# EAGLE design home automation (EAGLE 9.6.2)
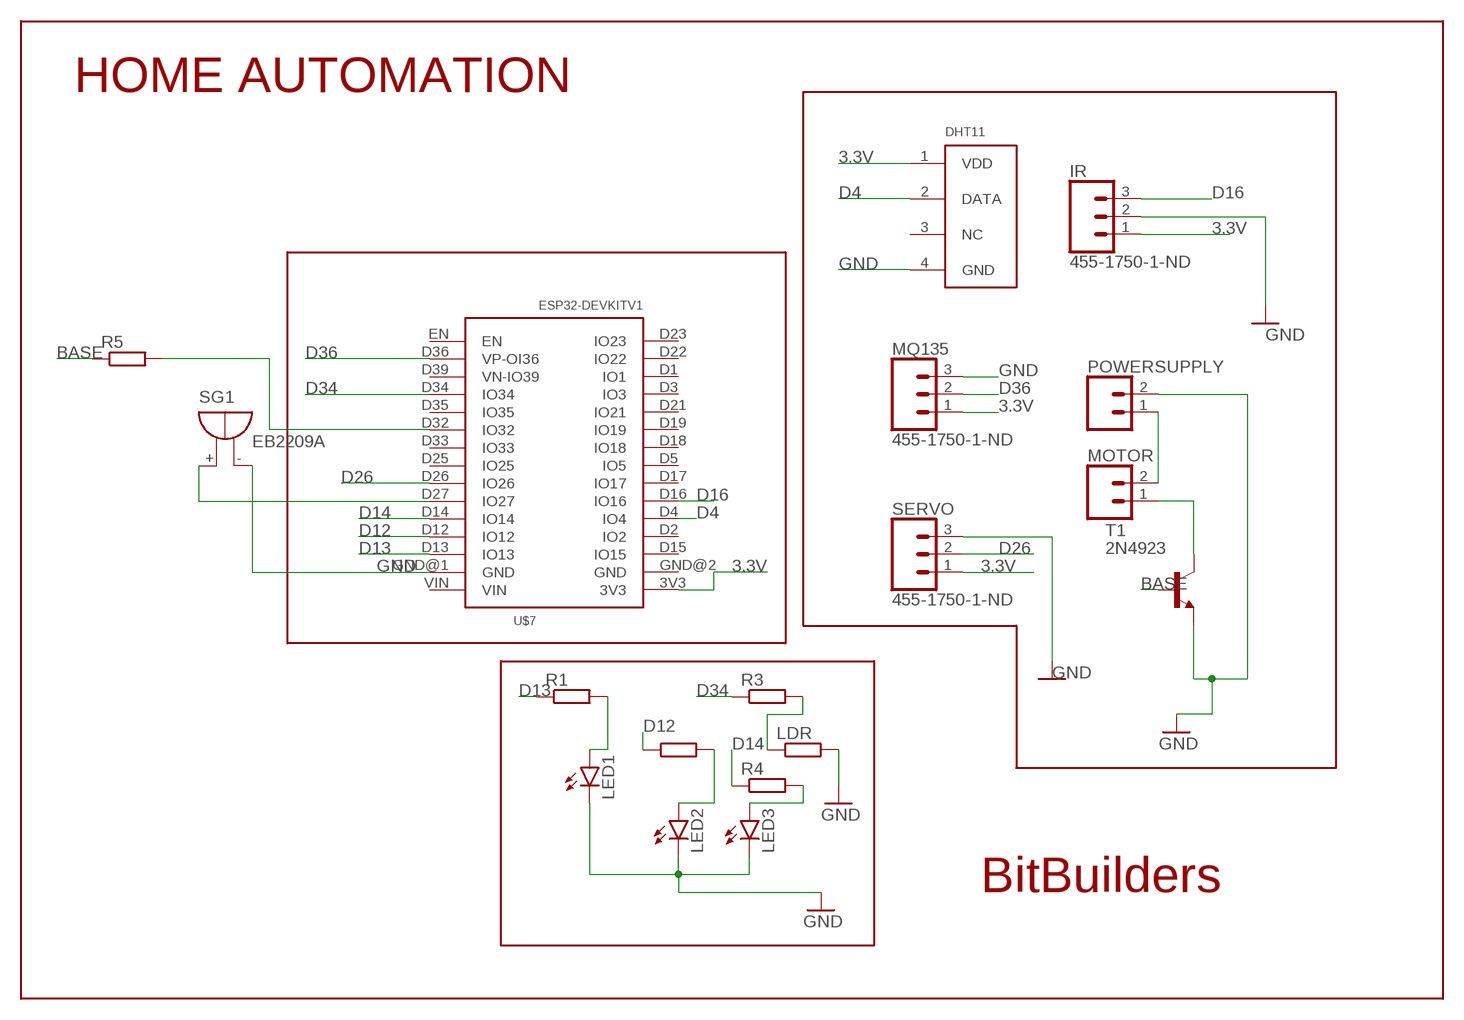
[diagram p0: schematic, sheet 1]

## Parts
DHT11  DHT11  [DHT11]
IR  455-1750-1-ND  CONN_03  [1X03]
LDR  R-EU_0204/7  [0204/7]
LED1  LED5MM  [LED5MM]
LED2  LED5MM  [LED5MM]
LED3  LED5MM  [LED5MM]
MOTOR  CONN_02  [1X02]
MQ135  455-1750-1-ND  CONN_03  [1X03]
POWERSUPPLY  CONN_02  [1X02]
R1  R-EU_0204/5  [0204/5]
R2  R-EU_0204/5  [0204/5]
R3  R-EU_0204/5  [0204/5]
R4  R-EU_0204/7  [0204/7]
R5  R-EU_0204/7  [0204/7]
SERVO  455-1750-1-ND  CONN_03  [1X03]
SG1  EB2209A  [EB2209A]
T1  2N4923  [TO126]
U$7  ESP32DEVKITV1  [ESP32-DEVKITV1]

## Nets
3.3V: DHT11.1(VDD) IR.1 MQ135.1 SERVO.1 U$7.3V3
BASE: R5.1 T1.3(B)
D4: DHT11.2(DATA) U$7.D4(IO4)
D12: R2.1 U$7.D12(IO12)
D13: R1.1 U$7.D13(IO13)
D14: R4.1 U$7.D14(IO14)
D16: IR.3 U$7.D16(IO16)
D26: SERVO.2 U$7.D26(IO26)
D34: R3.1 U$7.D34(IO34)
D36: MQ135.2 U$7.D36(VP-OI36)
GND: DHT11.4(GND) IR.2 LDR.2 LED1.K(C) LED2.K(C) LED3.K(C) MQ135.3 POWERSUPPLY.2 SERVO.3 SG1.- T1.1(E) U$7.GND@1(GND)
N$3: SG1.+ U$7.D27(IO27)
N$5: MOTOR.1 T1.2(C)
N$7: LED1.A R1.2
N$9: LED2.A R2.2
N$10: LED3.A R4.2
N$11: LDR.1 R3.2
N$16: MOTOR.2 POWERSUPPLY.1
N$17: R5.2 U$7.D32(IO32)
Unconnected: DHT11.3(NC) U$7.D1(IO1) U$7.D2(IO2) U$7.D3(IO3) U$7.D5(IO5) U$7.D15(IO15) U$7.D17(IO17) U$7.D18(IO18) U$7.D19(IO19) U$7.D21(IO21) U$7.D22(IO22) U$7.D23(IO23) U$7.D25(IO25) U$7.D33(IO33) U$7.D35(IO35) U$7.D39(VN-IO39) U$7.EN U$7.GND@2(GND) U$7.VIN

## Notes on the sheet
- HOME AUTOMATION
- BitBuilders

## Library data of the parts
DHT11 = dht:DHT11
IR MQ135 SERVO = SparkFun-Connectors:CONN_03: Multi connection point. Often used as Generic Header-pin footprint for 0.1 inch spaced/style header connections On any of the 0.1 inch spaced packages, you can populate with these: Break Away Headers - Straight <https://www.sparkfun.com/products/116> (PRT-00116) Break Away Male Headers - Right Angle <https://www.sparkfun.com/products/553> (PRT-00553) Female Headers <https://www.sparkfun.com/products/115> (PRT-00115) Break Away Headers - Machine Pin <https://www.sparkfun.com/products/117> (PRT-00117) Break Away Female Headers - Swiss Machine Pin <https://www.sparkfun.com/products/743> (PRT-00743) Stackable Header - 3 Pin (Female, 0.1") <https://www.sparkfun.com/products/13875> (PRT-13875) For SCREWTERMINALS and SPRING TERMINALS visit here: Screw Terimnals on SparkFun.com <https://www.sparkfun.com/search/results?term=Screw+Terminals> (5mm/3.5mm/2.54mm spacing) This device is also useful as a general connection point to wire up your design to another part of your project. Our various solder wires solder well into these plated through hole pads. Hook-Up Wire - Assortment (Stranded, 22 AWG) <https://www.sparkfun.com/products/11375> (PRT-11375) Hook-Up Wire - Assortment (Solid Core, 22 AWG) <https://www.sparkfun.com/products/11367> (PRT-11367) View the entire wire category on our website here <https://www.sparkfun.com/categories/141> Special notes: Molex polarized connector foot print use with SKU : PRT-08232 with associated crimp pins and housings.; PROD_ID: XXX-00000
LDR R1-R5 = rcl:R-EU_: RESISTOR, European symbol; SPICEPREFIX: R
LED1-LED3 = led:LED: LED OSRAM: - CHIPLED LG R971, LG N971, LY N971, LG Q971, LY Q971, LO R971, LY R971 LH N974, LH R974 LS Q976, LO Q976, LY Q976 LO Q996 - Hyper CHIPLED LW Q18S LB Q993, LB Q99A, LB R99A - SideLED LS A670, LO A670, LY A670, LG A670, LP A670 LB A673, LV A673, LT A673, LW A673 LH A674 LY A675 LS A676, LA A676, LO A676, LY A676, LW A676 LS A679, LY A679, LG A679 - Hyper Micro SIDELED® LS Y876, LA Y876, LO Y876, LY Y876 LT Y87S - SmartLED LW L88C, LW L88S LB L89C, LB L89S, LG L890 LS L89K, LO L89K, LY L89K LS L896, LA L896, LO L896, LY L896 - TOPLED LS T670, LO T670, LY T670, LG T670, LP T670 LSG T670, LSP T670, LSY T670, LOP T670, LYG T670 LG T671, LOG T671, LSG T671 LB T673, LV T673, LT T673, LW T673 LH T674 LS T676, LA T676, LO T676, LY T676, LB T676, LH T676, LSB T676, LW T676 LB T67C, LV T67C, LT T67C, LS T67K, LO T67K, LY T67K, LW E67C LS E67B, LA E67B, LO E67B, LY E67B, LB E67C, LV E67C, LT E67C LW T67C LS T679, LY T679, LG T679 LS T770, LO T770, LY T770, LG T770, LP T770 LB T773, LV T773, LT T773, LW T773 LH T774 LS E675, LA E675, LY E675, LS T675 LS T776, LA T776, LO T776, LY T776, LB T776 LHGB T686 LT T68C, LB T68C - Hyper Mini TOPLED® LB M676 - Mini TOPLED Santana® LG M470 LS M47K, LO M47K, LY M47K Source: http://www.osram.convergy.de LUXEON: - LUMILED® LXK2-PW12-R00, LXK2-PW12-S00, LXK2-PW14-U00, LXK2-PW14-V00 LXK2-PM12-R00, LXK2-PM12-S00, LXK2-PM14-U00 LXK2-PE12-Q00, LXK2-PE12-R00, LXK2-PE12-S00, LXK2-PE14-T00, LXK2-PE14-U00 LXK2-PB12-K00, LXK2-PB12-L00, LXK2-PB12-M00, LXK2-PB14-N00, LXK2-PB14-P00, LXK2-PB14-Q00 LXK2-PR12-L00, LXK2-PR12-M00, LXK2-PR14-Q00, LXK2-PR14-R00 LXK2-PD12-Q00, LXK2-PD12-R00, LXK2-PD12-S00 LXK2-PH12-R00, LXK2-PH12-S00 LXK2-PL12-P00, LXK2-PL12-Q00, LXK2-PL12-R00 Source: www.luxeon.com KINGBRIGHT: KA-3528ASYC Source: www.kingbright.com
MOTOR POWERSUPPLY = SparkFun-Connectors:CONN_02: Multi connection point. Often used as Generic Header-pin footprint for 0.1 inch spaced/style header connections On any of the 0.1 inch spaced packages, you can populate with these: Break Away Headers - Straight <https://www.sparkfun.com/products/116> (PRT-00116) Break Away Male Headers - Right Angle <https://www.sparkfun.com/products/553> (PRT-00553) Female Headers <https://www.sparkfun.com/products/115> (PRT-00115) Break Away Headers - Machine Pin <https://www.sparkfun.com/products/117> (PRT-00117) Break Away Female Headers - Swiss Machine Pin <https://www.sparkfun.com/products/743> (PRT-00743) For SCREWTERMINALS and SPRING TERMINALS visit here: Screw Terimnals on SparkFun.com <https://www.sparkfun.com/search/results?term=Screw+Terminals> (5mm/3.5mm/2.54mm spacing) This device is also useful as a general connection point to wire up your design to another part of your project. Our various solder wires solder well into these plated through hole pads. Hook-Up Wire - Assortment (Stranded, 22 AWG) <https://www.sparkfun.com/products/11375> (PRT-11375) Hook-Up Wire - Assortment (Solid Core, 22 AWG) <https://www.sparkfun.com/products/11367> (PRT-11367) View the entire wire category on our website here <https://www.sparkfun.com/categories/141> Special notes: Molex polarized connector foot print use with: PRT-08233 with associated crimp pins and housings. 2.54_SCREWTERM for use with PRT-10571. 3.5mm Screw Terminal footprints for PRT-08084 5mm Screw Terminal footprints for use with PRT-08432
SG1 = buzzer:EB2209A: BUZZER Source: Buerklin; OC_FARNELL: unknown; OC_NEWARK: unknown
T1 = transistor:2N4923: NPN TRANSISTOR
U$7 = ESP32-DEVKITV1:ESP32DEVKITV1

## Board
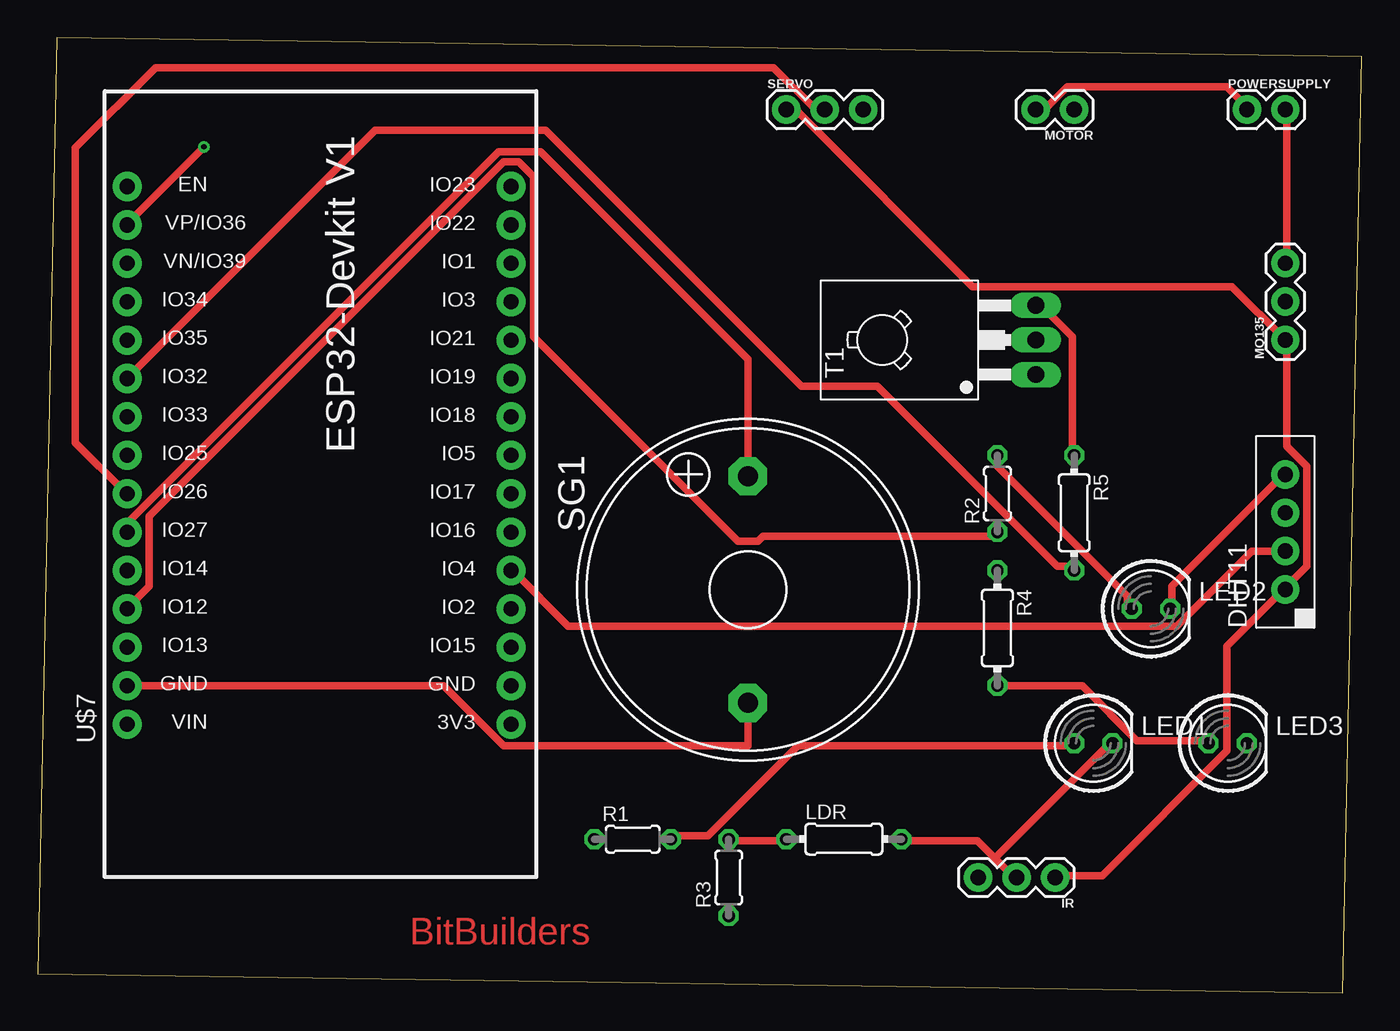
[diagram p1: board, top side]
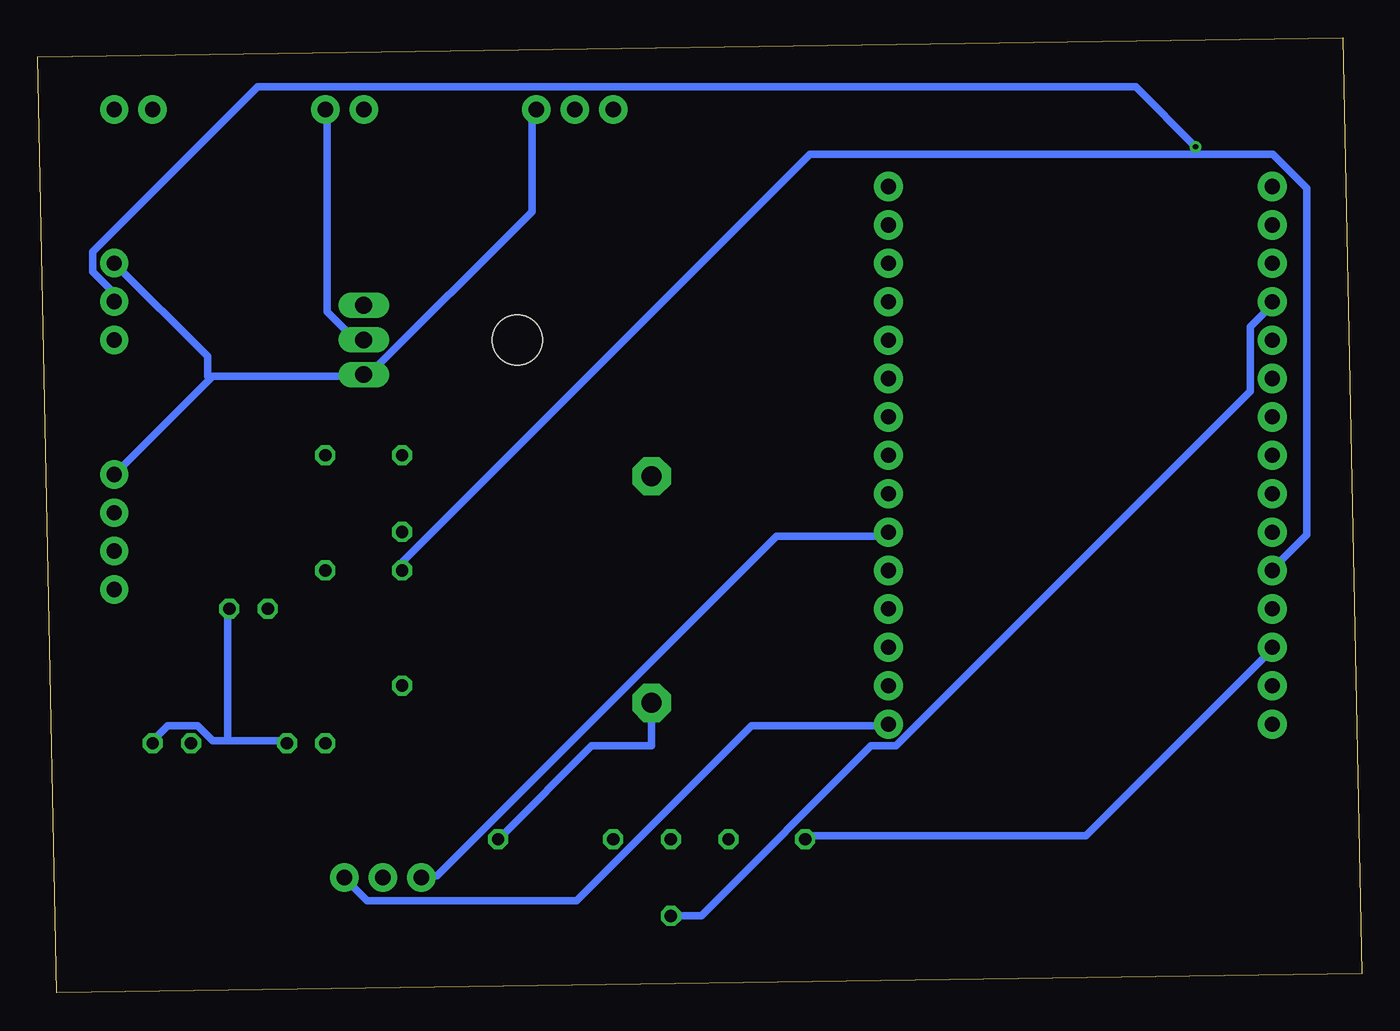
[diagram p2: board, bottom side, seen from below]

Size 87.61 x 63.17 mm. Coordinates in mm from the lower left corner, seen from the top.
Outline: 0,1.27 86.34,0 87.61,61.9 1.27,63.17 0,1.27
Copper layers (1*16): Top 0.035mm / dielectric 1.5mm / Bottom 0.035mm
Design rules "default *": minimum track width 20mil, minimum drill 0.35mm, track to track 6mil, track to pad 6mil, pad to pad 6mil, via to via 6mil, smd to smd 6mil, copper to edge 40mil, drill to drill 6mil, minimum pad ring 10mil, minimum via ring 8mil, stop-mask expansion 4mil, vias tented up to drill 0mil, thermal gap 10mil

### Footprints (pad centres in the part's own frame; a part is rotated, then mirrored left to right if it is on the bottom)
DHT11 = drill 1.016 pad 1.88: 1 -3.81,0; 2 -1.27,0; 3 1.27,0; 4 3.81,0
1X03 = drill 1.016 pad 1.88: 1 0,0; 2 2.54,0; 3 5.08,0
0204/7 = drill 0.813 octagon: 1 -3.81,0; 2 3.81,0
LED5MM = drill 0.813 octagon: A -1.27,0; K 1.27,0
1X02 = drill 1.016 pad 1.88: 1 0,0; 2 2.54,0
0204/5 = drill 0.813 octagon: 1 -2.54,0; 2 2.54,0
EB2209A = drill 1.321 pad 2.54 octagon: + 7.493,0; - -7.493,0
TO126 = drill 1.118 long: 1 -2.286,-5.08; 2 0,-5.08; 3 2.286,-5.08 | hole 3.302: 0,5.08
ESP32-DEVKITV1 = drill 1 pad 1.93: 3V3 -16.52,-12.27; D1 13.96,-12.27; D2 -8.9,-12.27; D3 11.42,-12.27; D4 -6.36,-12.27; D5 1.26,-12.27; D12 -8.9,13.135; D13 -11.44,13.135; D14 -6.36,13.135; D15 -11.44,-12.27; D16 -3.82,-12.27; D17 -1.28,-12.27; D18 3.8,-12.27; D19 6.34,-12.27; D21 8.88,-12.27; D22 16.5,-12.27; D23 19.04,-12.27; D25 1.26,13.135; D26 -1.28,13.135; D27 -3.82,13.135; D32 6.34,13.135; D33 3.8,13.135; D34 11.42,13.135; D35 8.88,13.135; D36 16.5,13.135; D39 13.96,13.135; EN 19.04,13.135; GND@1 -13.98,13.135; GND@2 -13.98,-12.27; VIN -16.52,13.135

### Placement (x,y rotation side)
DHT11  82.55,30.48 90 top
IR  67.31,7.62 180 top
LDR  53.34,10.16 0 top
LED1  69.85,16.51 0 top
LED2  73.66,25.4 0 top
LED3  78.74,16.51 0 top
MOTOR  68.58,58.42 180 top
MQ135  82.55,43.18 90 top
POWERSUPPLY  80.01,58.42 0 top
R1  39.37,10.16 0 top
R2  63.5,33.02 90 top
R3  45.72,7.62 90 top
R4  63.5,24.13 270 top
R5  68.58,31.75 270 top
SERVO  49.53,58.42 0 top
SG1  46.99,26.67 90 top
T1  60.96,43.18 90 top
U$7  19.05,34.29 90 top

### Tracks (layer width: path | path; a pad name or v marks a point on that pad's centre or on a via)
3.3V
  Top 0.508: IR.1 67.46,7.75 70.43,7.75 78.69,16 78.69,22.94 82.32,26.57 DHT11.1 82.65,26.9 83.97,28.22 83.97,34.82 82.65,36.14 82.65,43.08 MQ135.1 79.02,46.71 61.85,46.71 50.29,58.27 49.63,58.27 SERVO.1
  Bottom 0.508: U$7.3V3 31.47,17.65 40.39,17.65 51.94,6.1 65.81,6.1 67.13,7.42 IR.1
BASE
  Top 0.508: R5.1 68.45,35.81 68.45,43.41 66.14,45.72 T1.3
D4
  Top 0.508: DHT11.2 80.34,29.21 75.39,24.26 35.1,24.26 31.47,27.89 U$7.D4
D12
  Top 0.508: R2.1 63.5,30.2 47.98,30.2 47.65,29.87 46.33,29.87 32.79,43.41 32.79,53.98 31.8,54.97 30.81,54.97 7.37,31.52 7.37,26.9 6.05,25.58 U$7.D12
D13
  Bottom 0.508: R1.1 36.75,10.39 18.26,10.39 6.05,22.61 U$7.D13
D14
  Bottom 0.508: R4.1 63.5,28.47 36.5,55.47 5.89,55.47 3.63,53.21 3.63,30.3 5.72,28.22 U$7.D14
D16
  Bottom 0.508: IR.3 62.18,7.75 61.19,7.75 38.73,30.2 31.47,30.2 U$7.D16
D26
  Top 0.508: SERVO.2 51.94,58.6 51.28,58.6 48.69,61.19 7.8,61.19 2.49,55.88 2.49,36.4 5.72,33.17 U$7.D26
D34
  Bottom 0.508: R3.1 45.67,5.11 43.69,5.11 32.46,16.33 30.81,16.33 7.37,39.78 7.37,44.07 6.05,45.39 U$7.D34
D36  (via drill 0.35)
  Top 0.508: v11,55.96 6.05,51 U$7.D36
  Bottom 0.508: v11,55.96 14.96,59.92 73.08,59.92 83.97,49.02 83.97,47.7 82.65,46.38 82.65,45.72 MQ135.2
GND
  Top 0.508: U$7.GND@1 6.05,20.3 26.85,20.3 30.81,16.33 46.99,16.33 SG1.- | 63.34,8.9 64.49,7.75 IR.2 | 63.34,8.9 62.18,10.06 57.23,10.06 LDR.2 | 63.34,8.9 71.09,16.66 LED1.K | MQ135.3 82.65,48.36 82.65,58.27 POWERSUPPLY.2 | LED2.K 75.06,25.58 75.06,26.9 82.32,34.16 DHT11.4
  Bottom 0.508: 75.06,16.66 76.05,16.66 77.04,17.65 79.02,17.65 80.01,16.66 LED3.K | 75.06,16.66 71.42,16.66 LED1.K | 75.06,16.66 75.06,25.25 LED2.K | 76.21,40.6 82.32,34.49 DHT11.4 | 76.21,40.6 76.05,40.77 66.14,40.77 T1.1 65.81,40.77 54.91,51.66 54.91,58.27 SERVO.3 | MQ135.3 76.38,42.09 76.38,40.77 76.21,40.6 | SG1.- 46.99,16.33 50.95,16.33 56.9,10.39 LDR.2
N$3
  Top 0.508: SG1.+ 46.99,41.91 33.27,55.63 30.48,55.63 6.05,31.19 6.05,30.53 U$7.D27
N$5
  Bottom 0.508: T1.2 66.14,43.41 66.8,43.41 68.45,45.06 68.45,58.27 MOTOR.1
N$7
  Top 0.508: R1.2 42.04,10.39 44.35,10.39 50.29,16.33 68.45,16.33 LED1.A
N$9
  Top 0.508: R2.2 63.5,34.82 72.08,26.24 72.08,25.58 LED2.A
N$10
  Top 0.508: LED3.A 77.37,16.66 72.75,16.66 69.11,20.3 63.5,20.3 R4.2
N$11
  Top 0.508: R3.2 46,10.06 49.3,10.06 LDR.1
N$16
  Top 0.508: MOTOR.2 66.14,58.6 66.8,58.6 68.12,59.92 78.69,59.92 80.01,58.6 POWERSUPPLY.1
N$17
  Top 0.508: R5.2 68.45,28.22 67.46,28.22 55.58,40.11 50.55,40.11 33.6,57.05 22.33,57.05 6.05,40.77 U$7.D32

### Text on the board
Top: BitBuilders